# EAGLE design 214_oled_for_JetRacer (EAGLE 9.6.2)
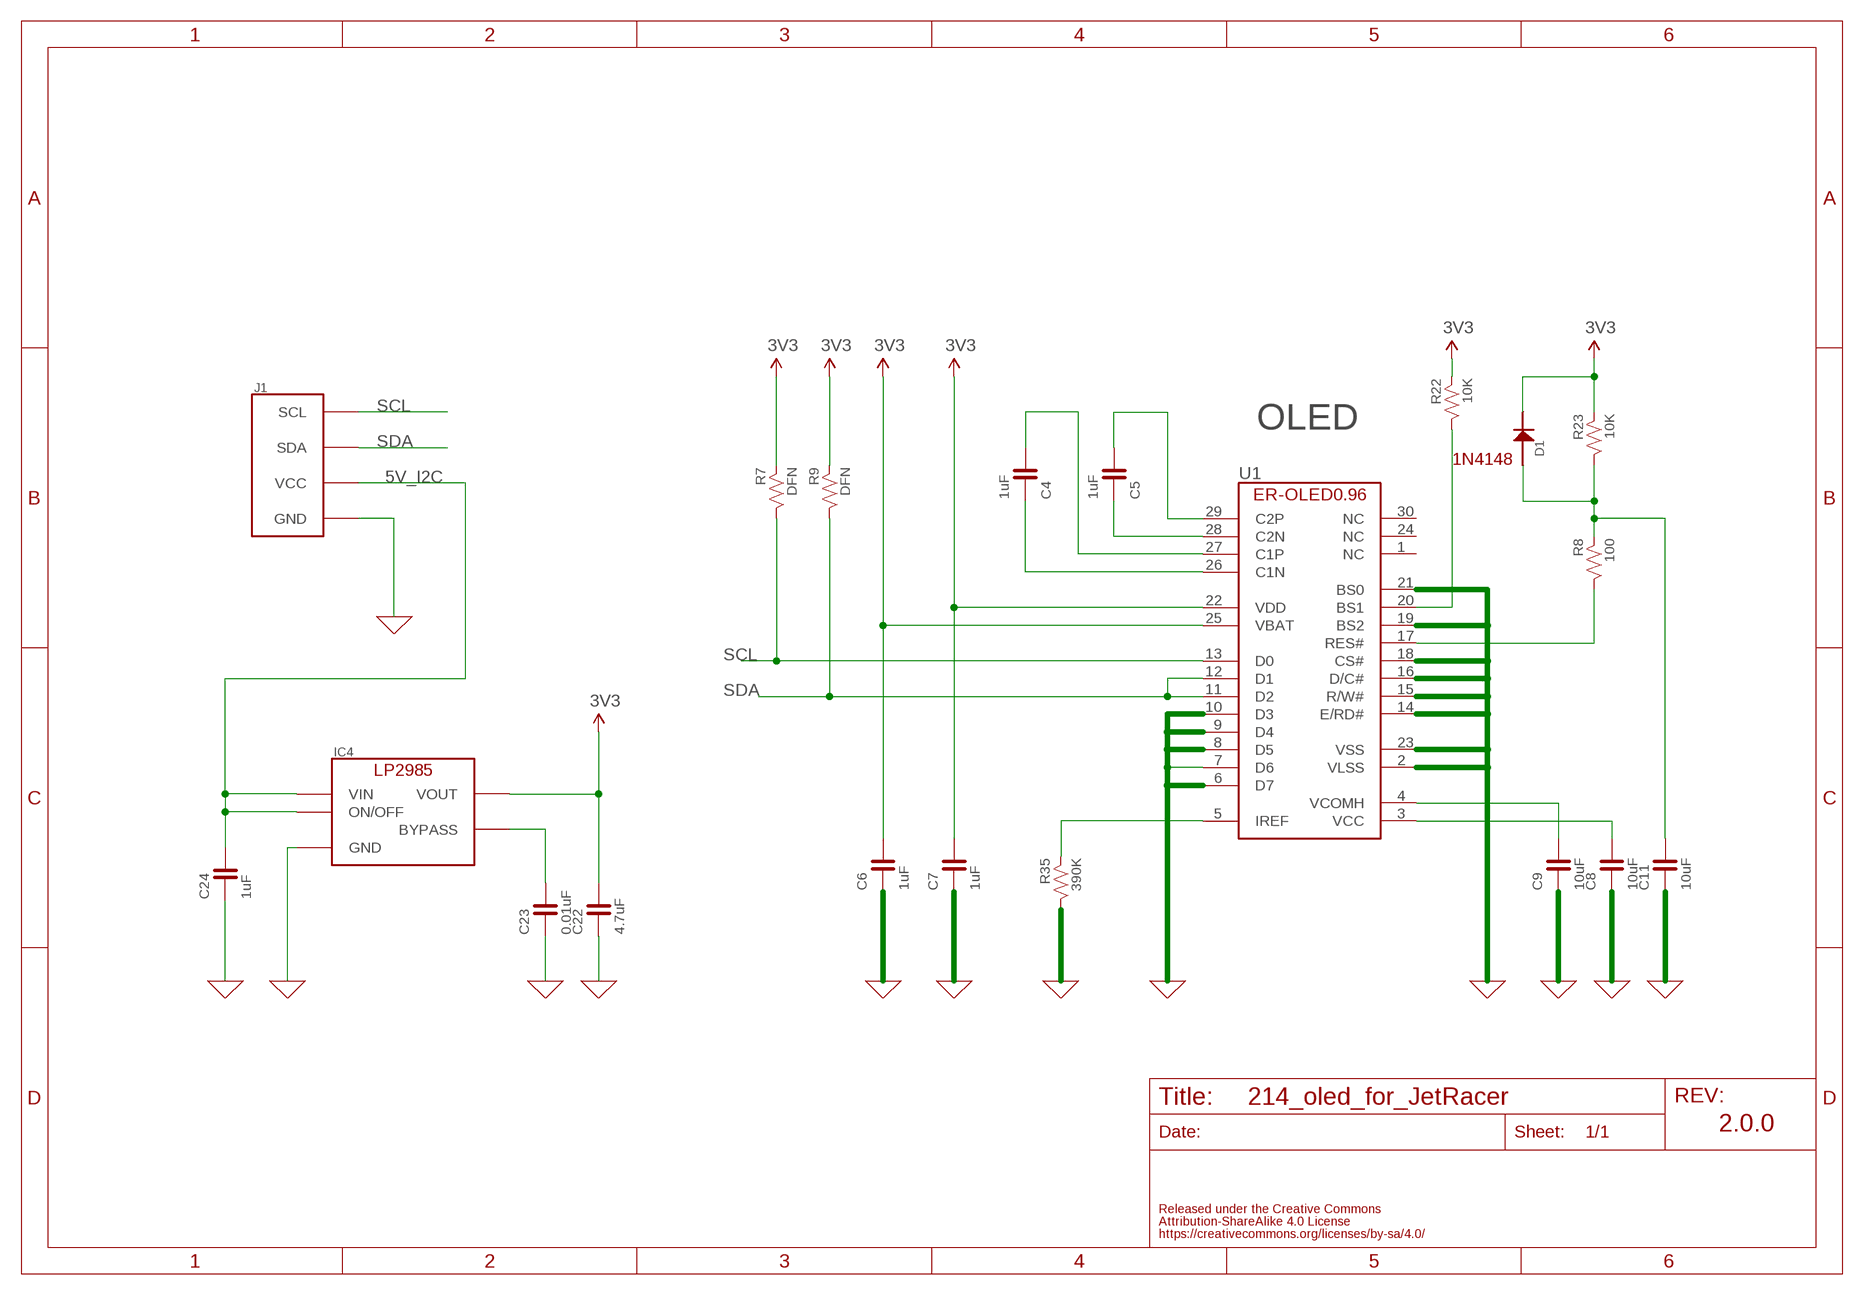
[diagram p0: schematic, sheet 1]

## Parts
C4  1uF  CAPACITOR-0603  [0603]
C5  1uF  CAPACITOR-0603  [0603]
C6  1uF  CAPACITOR-0603  [0603]
C7  1uF  CAPACITOR-0603  [0603]
C8  10uF  CAPACITOR-0603  [0603]
C9  10uF  CAPACITOR-0603  [0603]
C11  10uF  CAPACITOR-0603  [0603]
C22  4.7uF  CAPACITOR-0603  [0603]
C23  0.01uF  CAPACITOR-0603  [0603]
C24  1uF  CAPACITOR-0603  [0603]
D1  1N4148  [1N4148W]
IC4  LP2985-33DBV  [SOT-23-5]
J1  FABO_BRICK_I2C-S04B-PASK-2  [FABO_BRICK_I2C_S04B-PASK-2]
R7  DFN  RESISTOR-0603  [0603]
R8  100  RESISTOR-0603  [0603]
R9  DFN  RESISTOR-0603  [0603]
R22  10K  RESISTOR-0603  [0603]
R23  10K  RESISTOR-0603  [0603]
R35  390K  RESISTOR-0603  [0603]
U1  ER-OLED0.96-1ER-CON30HT-1  [ER-CON30HT-1]

## Nets
0: C6.1 C7.1 C8.1 C9.1 C11.1 C22.1 C23.1 C24.1 IC4.2(GND) J1.GND R35.2 U1.2(VLSS) U1.6(D7) U1.7(D6) U1.8(D5) U1.9(D4) U1.10(D3) U1.14(E/RD#) U1.15(R/W#) U1.16(D/C#) U1.18(CS#) U1.19(BS2) U1.21(BS0) U1.23(VSS) ; supply symbol labelled GND
3V3: C6.2 C7.2 C22.2 D1.CATHODE IC4.5(VOUT) R7.1 R9.1 R22.1 R23.1 U1.22(VDD) U1.25(VBAT)
5V_I2C: C24.2 IC4.1(VIN) IC4.3(ON/OFF) J1.VCC
N$2: C23.2 IC4.4(BYPASS)
N$16: C4.2 U1.27(C1P)
N$21: C4.1 U1.26(C1N)
N$22: C5.1 U1.28(C2N)
N$23: C5.2 U1.29(C2P)
N$24: R35.1 U1.5(IREF)
N$25: C9.2 U1.4(VCOMH)
N$26: C8.2 U1.3(VCC)
N$27: R8.2 U1.17(RES#)
N$28: C11.2 D1.ANODE R8.1 R23.2
N$50: R22.2 U1.20(BS1)
SCL: J1.SCL R7.2 U1.13(D0)
SDA: J1.SDA R9.2 U1.11(D2) U1.12(D1)
Unconnected: U1.1(NC) U1.24(NC) U1.30(NC)

## Notes on the sheet
- OLED
- 1N4148
- 2.0.0

## Library data of the parts
C4-C9 C11 C22-C24 = FaBo-Capacitor:CAPACITOR: CAPACITOR
D1 = FaBo-Diode:1N4148
IC4 = FaBo-Supply:LP2985: LP2985
J1 = FaBo-Template:FABO_BRICK_I2C: FaBo Brick I2C
R7-R9 R22 R23 R35 = FaBo-Resistors:RESISTOR: RESISTOR
U1 = FaBo-Display:ER-OLED0.96-1

## Board
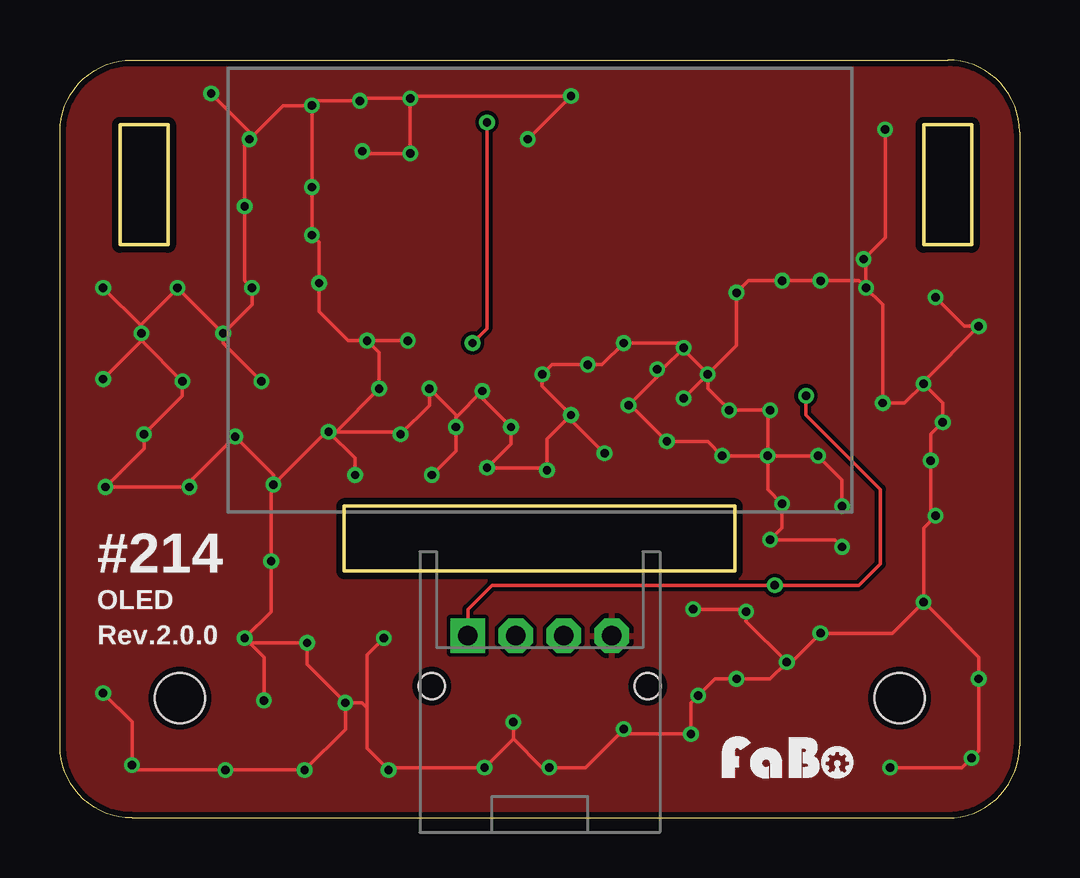
[diagram p1: board, top side]
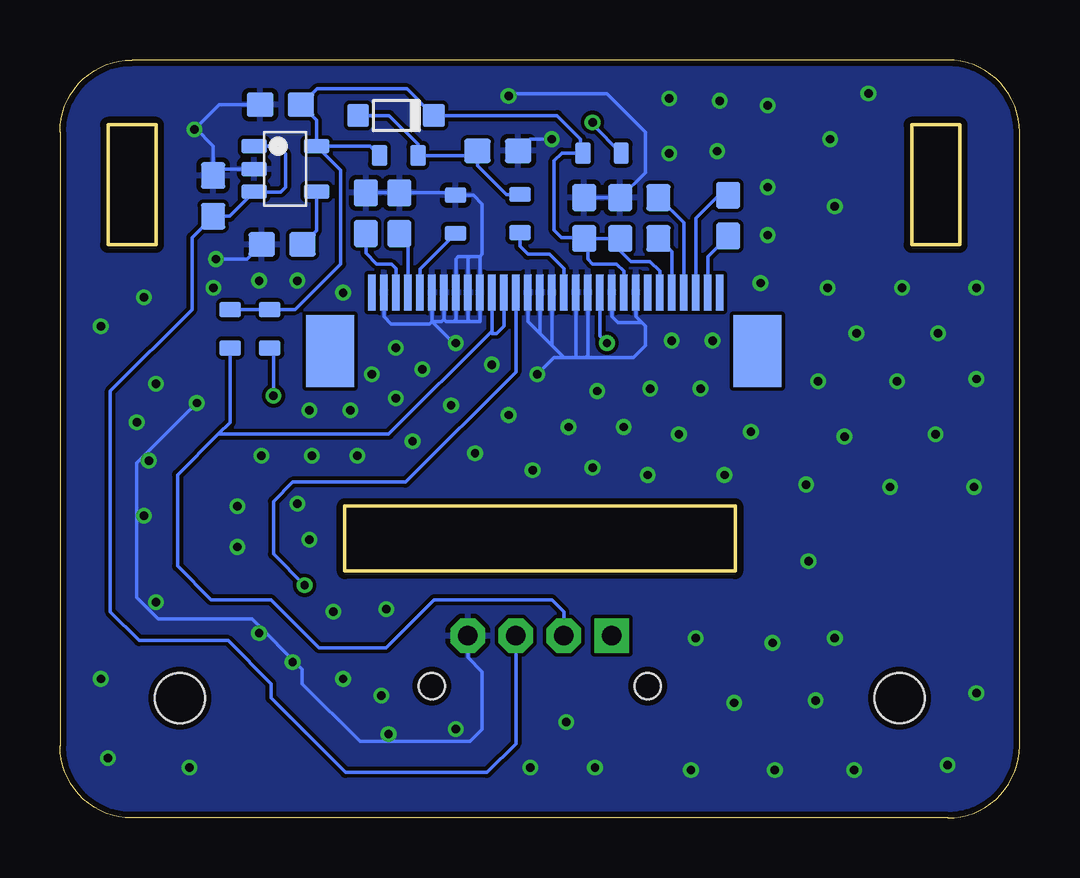
[diagram p2: board, bottom side, seen from below]

Size 40 x 31.6 mm. Coordinates in mm from the lower left corner, seen from the top.
Outline: 3,0 37,0 arc90 40,3 40,28.6 arc90 37,31.6 3,31.6 arc90 0,28.6 0,3 arc90 3,0
Outline: 11.85,10.29 28.13,10.29 28.13,13 11.85,13 11.85,10.29
Outline: 2.5,28.9 4.5,28.9 4.5,23.9 2.5,23.9 2.5,28.9
Outline: 36,28.9 38,28.9 38,23.9 36,23.9 36,28.9
Copper layers (1*16): Top 0.035mm / dielectric 1.6mm / Bottom 0.035mm
Design rules "PCBway": minimum track width 6mil, minimum drill 12mil, track to track 6mil, track to pad 6mil, pad to pad 6mil, via to via 6mil, smd to smd 6mil, copper to edge 10mil, drill to drill 10mil, minimum pad ring 10mil, minimum via ring 6mil, stop-mask expansion 2mil, vias tented up to drill 100mil, thermal gap 8mil
Holes 2.1 mm at 5,5 35,5
bRestrict: 8 lines

### Footprints (pad centres in the part's own frame; a part is rotated, then mirrored left to right if it is on the bottom)
0603 = smd 1.1 x 1: 1 -0.85,0; 2 0.85,0
1N4148W = smd 0.9 x 0.95: ANODE 0,0; CATHODE 3.15,0
SOT-23-5 = smd 0.6 x 1.05: 1 -0.95,-1.3; 2 0,-1.3; 3 0.95,-1.3; 4 0.95,1.3; 5 -0.95,1.3
FABO_BRICK_I2C_S04B-PASK-2 = drill 0.8 pad 1.422 octagon: GND -3,0; SDA 1,0; VCC -1,0 | drill 0.8 pad 1.422 square: SCL 3,0 | hole 1.1: 4.5,2.1; -4.5,2.1
0603' = smd 0.65 x 0.9: 1 -0.8,0; 2 0.8,0
ER-CON30HT-1 = smd 0.3 x 1.5 bottom: 1 7,-0.23; 2 6.5,-0.23; 3 6,-0.23; 4 5.5,-0.23; 5 5,-0.23; 6 4.5,-0.23; 7 4,-0.23; 8 3.5,-0.23; 9 3,-0.23; 10 2.5,-0.23; 11 2,-0.23; 12 1.5,-0.23; 13 1,-0.23; 14 0.5,-0.23; 15 0,-0.23; 16 -0.5,-0.23; 17 -1,-0.23; 18 -1.5,-0.23; 19 -2,-0.23; 20 -2.5,-0.23; 21 -3,-0.23; 22 -3.5,-0.23; 23 -4,-0.23; 24 -4.5,-0.23; 25 -5,-0.23; 26 -5.5,-0.23; 27 -6,-0.23; 28 -6.5,-0.23; 29 -7,-0.23; 30 -7.5,-0.23 | smd 2 x 3 bottom: 31 -9.07,-2.67; 32 8.74,-2.67

### Placement (x,y rotation side)
C4  15.05,25.01 90 bottom
C5  12.15,25.11 270 bottom
C6  18.15,25.01 270 bottom
C7  16.65,25.01 270 bottom
C8  27.25,25.21 270 bottom
C9  25.85,25.21 270 bottom
C11  21.75,27.81 180 bottom
C22  30.8,29.73 0 bottom
C23  30.74,23.91 0 bottom
C24  33.62,25.93 270 bottom
D1  27.57,29.28 0 bottom
IC4  30.61,27.05 270 bottom
J1  20,7.6 180 top
R7  DFN  [0603']  31.25,20.39 270 bottom
R8  100  [0603']  20.83,25.2 270 bottom
R9  DFN  [0603']  32.91,20.39 270 bottom
R22  10K  [0603']  17.41,27.72 0 bottom
R23  10K  [0603']  25.88,27.62 0 bottom
R35  390K  [0603']  23.52,25.17 90 bottom
U1  20,22.14 0 top
U$1  [LOGO_FABO_S]  30.4,1.5 0 top

### Tracks (layer width: path | path; a pad name or v marks a point on that pad's centre or on a via)
0  (via drill 0.35)
  Top 0.152: v19.5,28.3 v21.3,30.1 14.82,30.1 14.6,29.88 | v34.4,28.7 34.4,24.2 v33.5,23.3 33.6,23.2 v33.6,22.1 | v11.2,16.1 12.3,15 v12.3,14.3 | v10.5,29.7 10.7,29.9 v12.5,29.9 12.6,30 v14.6,30 14.6,29.88 | 14.6,29.88 v14.6,27.7 12.7,27.7 v12.6,27.8 | v10.5,29.7 v10.5,26.3 v10.5,24.3 10.8,24 v10.8,22.3 10.8,21.11 12.01,19.9 v12.8,19.9 | v12.8,19.9 v14.5,19.9 | v12.8,19.9 13.3,19.4 v13.3,17.9 11.5,16.1 v11.2,16.1 | v11.2,16.1 14.1,16.1 v14.2,16 15.4,17.2 v15.4,17.9 16.5,16.8 v16.5,16.3 | v16.5,16.3 16.5,15.3 v15.5,14.3 | v16.5,16.3 16.5,16.7 v17.6,17.8 17.6,17.5 v18.8,16.3 18.8,15.6 v17.8,14.6 20.2,14.6 v20.3,14.5 20.3,15.8 v21.3,16.8 | v21.3,16.8 20.1,18 v20.1,18.5 20.5,18.9 v22,18.9 22.6,18.9 v23.5,19.8 25.8,19.8 v26,19.6 | v21.3,16.8 21.3,16.6 v22.7,15.2 | v26,19.6 25.1,18.7 v24.9,18.7 24.9,18.4 v23.7,17.2 23.8,17.2 v25.3,15.7 27,15.7 v27.6,15.1 v29.5,15.1 | v29.5,15.1 v31.6,15.1 32.6,14.1 v32.6,13 | v29.5,15.1 29.5,13.7 v30.1,13.1 30.1,12.1 v29.6,11.6 32.3,11.6 v32.6,11.3 | v29.5,15.1 29.5,16.9 v29.6,17 v27.9,17 27,17.9 27,18.4 | 27,18.4 v27,18.5 | v27,18.5 26,19.5 v26,19.6 | v26,17.5 26.9,18.4 27,18.4 | v27,18.5 28.2,19.7 v28.2,21.9 28.7,22.4 v30.1,22.4 v31.7,22.4 33.3,22.4 v33.6,22.1 | v33.6,22.1 34.3,21.4 v34.3,17.3 35.2,17.3 v36,18.1 | v1.8,5.2 3,4 v3,2.2 3.2,2 v6.9,2 v10.2,2 11.9,3.7 v11.9,4.8 | v13.5,7.5 12.8,6.8 12.8,4.6 | 12.8,4.6 12.8,2.9 v13.7,2 13.8,2.1 v17.7,2.1 18.9,3.3 | v11.9,4.8 12.6,4.8 12.8,4.6 | v11.9,4.8 10.3,6.4 v10.3,7.3 7.9,7.3 v7.7,7.5 | v7.7,7.5 8.5,6.7 v8.5,4.9 | v7.7,7.5 8.8,8.6 v8.8,10.7 8.8,13.8 v8.9,13.9 | v8.9,13.9 11.1,16.1 v11.2,16.1 | v8.9,13.9 8.9,14.3 v7.3,15.9 5.4,14 v5.4,13.8 v1.9,13.8 3.5,15.4 v3.5,16 5.1,17.6 v5.1,18.2 3.4,19.9
  Top 0.152: v3.4,20.2 3.4,19.9 | 3.4,19.9 v1.8,18.3 | v1.8,22.1 3.4,20.5 v3.4,20.2 | v3.4,20.2 3.4,20.6 v4.9,22.1 v6.8,20.2 | v6.8,20.2 8,21.4 v8,22.1 7.7,22.4 v7.7,25.5 7.7,28.1 v7.9,28.3 | v8.4,18.2 6.8,19.8 v6.8,20.2 | v7.9,28.3 7.9,28.6 v6.3,30.2 | v7.9,28.3 9.3,29.7 v10.5,29.7 | v18.9,4 18.9,3.3 | 18.9,3.3 20.1,2.1 v20.4,2.1 21.9,2.1 v23.5,3.7 23.7,3.5 v26.3,3.5 26.3,4.8 v26.6,5.1 27.3,5.8 v28.2,5.8 29.6,5.8 30.25,6.45 | 30.25,6.45 v30.3,6.5 28.6,8.2 v28.6,8.6 28.5,8.7 v26.4,8.7 | v36,9 34.7,7.7 v31.7,7.7 30.45,6.45 30.25,6.45 | v36,9 36,12.1 v36.5,12.6 36.3,12.8 v36.3,14.9 36.3,16 v36.8,16.5 36.8,17.3 v36,18.1 | v36,9 38.3,6.7 v38.3,5.8 38.3,2.8 v38,2.5 37.6,2.1 v34.6,2.1 | v36,18.1 36,18.2 v38.3,20.5 37.7,20.5 v36.5,21.7
  Bottom 0.152: C6.1 C7.1 15.6,26.91 15.6,28.6 17.2,30.2 21.2,30.2 v21.3,30.1 | 22.5,23.4 22.4,23.5 22.4,25.6 22.77,25.97 R35.2 23.61,26.06 C9.1 C8.1 27.35,26.16 27.5,26.16 | 22.5,23.4 U1.10 22.5,20.7 22.9,20.7 | 22.9,23.4 23,23.3 U1.9 23,20.8 22.9,20.7 | 22.9,23.4 22.5,23.4 | 22.9,23.4 23.4,23.4 23.5,23.3 U1.8 23.5,20.8 23.6,20.7 | U1.7 24,20.8 | 24,20.8 23.9,20.7 23.6,20.7 | U1.6 24.5,20.7 | 24.5,20.7 24.1,20.7 24,20.8 | v19.5,28.3 20.41,28.3 C11.1 | 23.6,20.7 22.9,20.7 | U1.23 16,20.9 15.75,20.65 | 15.75,20.65 15.6,20.5 15.6,19.7 16.1,19.2 18.1,19.2 | 18.1,19.2 18.5,19.2 | 20,20.2 U1.15 | U1.18 18.5,19.2 | U1.19 18,19.3 18.1,19.2 | U1.21 17,20.9 16.75,20.65 15.75,20.65 | 27.55,26.16 27.5,26.16 | IC4.2 33.34,27.05 C24.1 33.62,28.02 34.35,28.75 | C23.1 32.2,23.3 v33.5,23.3 | v34.4,28.7 34.35,28.75 | 34.35,28.75 33.37,29.73 C22.1 | 27.5,25.8 27.5,26.16 | 18.5,19.2 19,19.2 | 19,19.2 19.5,19.7 | 19.5,19.7 20,20.2 | U1.16 19.5,19.7 | 20,20.2 20.5,20.7 U1.14 | 24.5,20.7 23.6,19.8 v23.5,19.8 | 19,19.2 19.4,19.2 v20.1,18.5 | U1.2 26.5,20.9 26.2,20.6 24.6,20.6 24.5,20.7 | J1.GND 23,6.7 22.4,6.1 22.4,3.7 22.9,3.2 27.5,3.2 29.9,5.6 29.9,6.2 32,8.3 35.9,8.3 36.8,9.2 36.8,14.8 v34.3,17.3
  pour Bottom (rank 6): 0.04,34.4 40.4,34.4 42.1,32.7 42.1,2.6 37.8,-1.7 0.04,-1.7
  pour Top (rank 6): -1.1,33.8 0.8,35.7 38.5,35.7 42.9,31.3 42.9,2.1 39.5,-1.3 1.2,-1.3 -1.1,1
3V3
  Bottom 0.152: U1.25 15,22.8 15.4,23.2 16.2,23.2 16.65,23.65 C7.2 18,24.16 | 18,24.16 C6.2 18.19,24.2 19.1,24.2 19.4,24.5 19.4,27.4 19.08,27.72 18.3,27.72 | U1.22 16.5,22.8 16.8,23.1 17.8,23.1 18,23.3 18,24.16 | 18.3,27.72 R22.1 | 18.3,27.72 18.3,28.3 19.28,29.28 D1.CATHODE 25.54,30.4 29.29,30.4 C22.2 29.3,29.09 IC4.5 | R23.1 27.07,28 IC4.5 | R9.1 R7.1 30.2,21.2 28.3,23.1 28.3,27 IC4.5
5V_I2C
  Bottom 0.152: IC4.1 30.9,28 30.6,27.7 30.6,26.3 30.8,26.1 IC4.3 32.92,25.09 C24.2 34.5,24.2 34.5,21.2 37.9,17.8 37.9,8.6 36.7,7.4 33,7.4 31.2,5.6 31.2,5 28.1,1.9 22.2,1.9 21,3.1 J1.VCC
N$2
  Bottom 0.152: C23.2 29.3,24.5 IC4.4
N$16
  Bottom 0.152: U1.27 14,24.81 C4.2
N$21
  Bottom 0.152: U1.26 14.5,23.61 C4.1
N$22
  Bottom 0.152: U1.28 13.5,25 12.54,25.96 C5.1
N$23
  Bottom 0.152: C5.2 13,23.41 U1.29
N$24
  Bottom 0.152: R35.1 25,22.89 U1.5
N$25
  Bottom 0.152: U1.4 25.5,24.01 C9.2
N$26
  Bottom 0.152: U1.3 26,22.9 26.18,23.08 26.39,23.08 26.41,23.1 26.8,23.1 27.25,23.55 C8.2
N$27
  Bottom 0.152: U1.17 19,22.9 19.6,23.5 20.5,23.5 20.83,23.83 R8.2
N$28
  Bottom 0.152: R8.1 21.39,26 22.6,27.2 C11.2 | C11.2 | C11.2 22.78,27.62 R23.2 25.08,28.08 26.28,29.28 D1.ANODE
N$50  (via drill 0.35)
  Top 0.152: v17.8,29 17.8,20.4 v17.2,19.8
  Bottom 0.152: U1.20 17.5,20.1 v17.2,19.8 | v17.8,29 17.8,28.91 R22.2
SCL  (via drill 0.35)
  Top 0.152: v31.1,17.6 31.1,16.8 34.2,13.7 34.2,10.6 33.3,9.7 v29.8,9.7 18,9.7 17,8.7 J1.SCL
  Bottom 0.152: U1.13 21,18.6 25.6,14 30.3,14 31.1,13.2 31.1,11 v29.8,9.7 | v31.1,17.6 31.1,19.44 R7.2
SDA
  Bottom 0.152: 33.4,16 26.3,16 22,20.3 | 22,20.3 22,20.2 21.8,20.2 21.5,20.5 U1.12 | 22,20.3 U1.11 | R9.2 32.91,16.5 33.4,16 | J1.SDA 19,8.6 19.5,9.1 24.4,9.1 26.4,7.1 29.2,7.1 31.2,9.1 33.7,9.1 35.1,10.5 35.1,14.3 33.4,16

### Text on the board
tPlace: #214 | OLED | Rev.2.0.0
Document: #214 LED JetRacer Type N Rev2.0.1 / 2022/03/07